# EAGLE schematic CS-I-SEN-LIGHT-NPN (EAGLE 6.4)
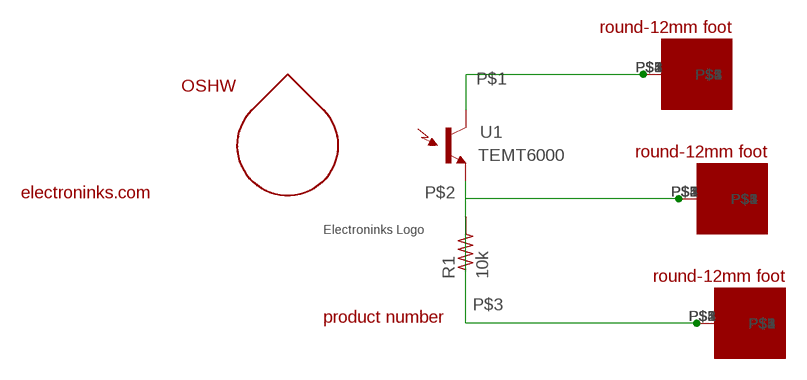
[diagram p0: schematic, sheet 1]

## Parts
R1  10k  R-US_R0603  [R0603]
U1  TEMT6000  [TEMT6000-SEN]
U$1  ROUND-12MM-FOOT-1.8MM  [ROUND-12MM-FOOT]
U$2  ROUND-12MM-FOOT-1.8MM  [ROUND-12MM-FOOT]
U$3  ROUND-12MM-FOOT-1.8MM  [ROUND-12MM-FOOT]
U$4  ELECTRONINKS_LOGO_15MM  [ELECTRONINKS_LOGO_15MM]
U$5  ELECTRONINKS_COM_15MM  [ELECTRONINKS_COM_15MM]
U$6  DROPLET_LOGO_4MM  [DROPLET_LOGO_4MM]
U$7  OSHW_4MM  [OHSW_4MM]
U$8  CS_I_SEN_LIGHT_NPN  [CS_I_SEN_LIGHT_NPN]

## Nets
P$1: U1.COLLECTOR(C1) U$1.P$1 U$1.P$2 U$1.P$3 U$1.P$4 U$1.P$5
P$2: R1.1 U1.EMITTER(E1) U$2.P$1 U$2.P$2 U$2.P$3 U$2.P$4 U$2.P$5
P$3: R1.2 U$3.P$1 U$3.P$2 U$3.P$3 U$3.P$4 U$3.P$5

## Library data of the parts
R1 = rcl:R-US_: RESISTOR, American symbol
U1 = SparkFun:TEMT6000: Ambient Light Sensor Simple light detection sensor. Output varies with light intensity input. Spark Fun Electronics SKU : COM-08348
U$1-U$3 = electroninks:ROUND-12MM-FOOT-1.8MM
U$4 = electroninks:ELECTRONINKS_LOGO_15MM
U$5 = electroninks:ELECTRONINKS_COM_15MM
U$6 = electroninks:DROPLET_LOGO_4MM
U$7 = electroninks:OSHW_4MM
U$8 = electroninks:CS_I_SEN_LIGHT_NPN